# EAGLE design pc_pulse (EAGLE 6.4)
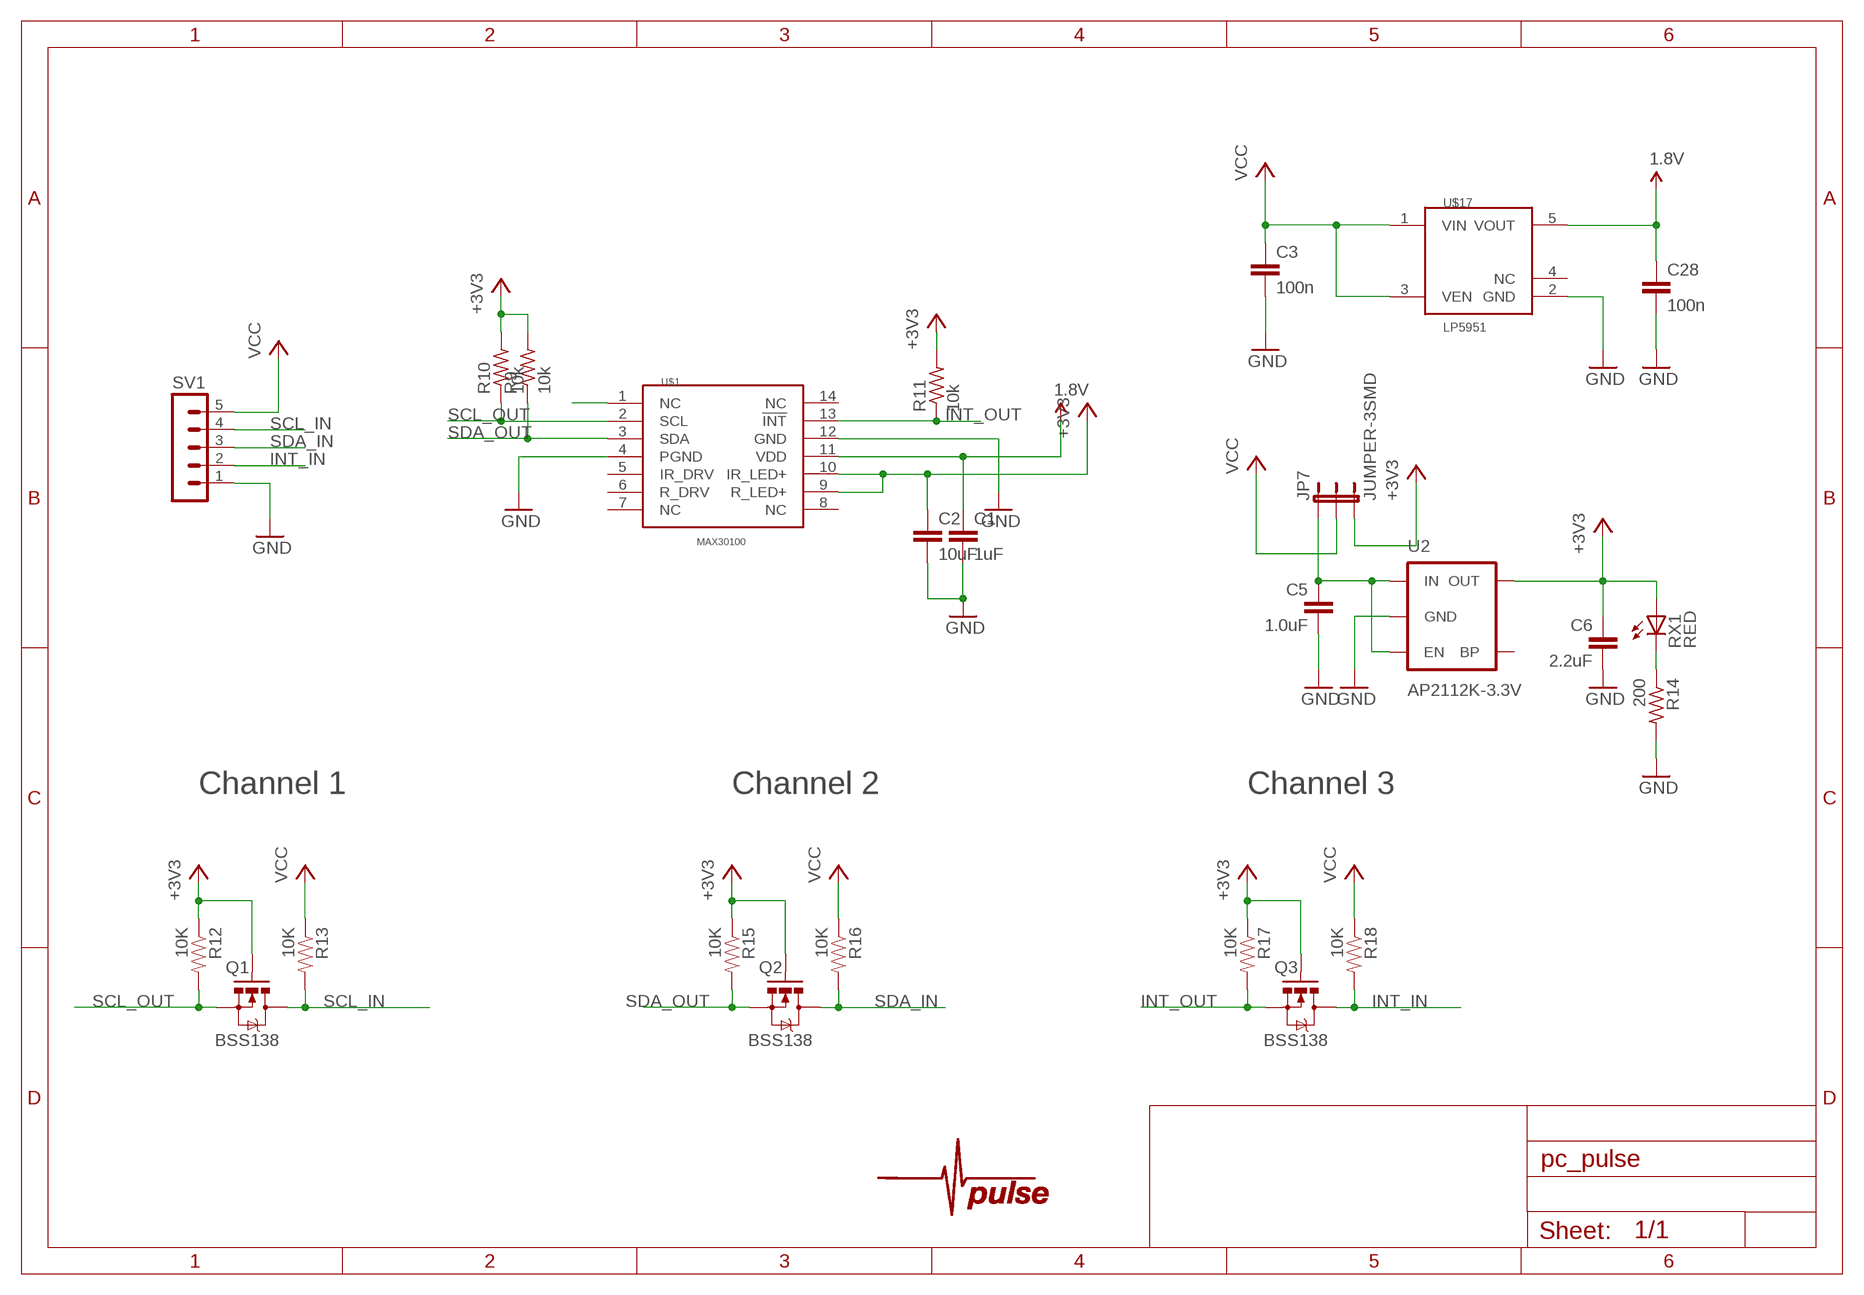
[diagram p0: schematic, sheet 1]

## Parts
C1  1uF  C-EUC0805  [C0805]
C2  10uF  C-EUC0805  [C0805]
C3  100n  C-EUC0402  [C0402]
C5  1.0uF  1.0UF-25V-+80/-20(0805)  [0805]
C6  2.2uF  C-EUC0805  [C0805]
C28  100n  C-EUC0402  [C0402]
JP7  JUMPER-3SMD  [SJ_3]
Q1  BSS138  MOSFET-NCHANNELSMD  [SOT23-3]
Q2  BSS138  MOSFET-NCHANNELSMD  [SOT23-3]
Q3  BSS138  MOSFET-NCHANNELSMD  [SOT23-3]
R9  10k  R-US_R0402  [R0402]
R10  10k  R-US_R0402  [R0402]
R11  10k  R-US_R0402  [R0402]
R12  10K  RESISTOR0402-RES  [0402-RES]
R13  10K  RESISTOR0402-RES  [0402-RES]
R14  200  R-US_R0402  [R0402]
R15  10K  RESISTOR0402-RES  [0402-RES]
R16  10K  RESISTOR0402-RES  [0402-RES]
R17  10K  RESISTOR0402-RES  [0402-RES]
R18  10K  RESISTOR0402-RES  [0402-RES]
RX1  RED  LEDCHIPLED_0603  [CHIPLED_0603]
SV1  MA05-1  [MA05-1]
U2  AP2112K-3.3V  V_REG_LDOSMD  [SOT23-5]
U$1  MAX30100  [OESIP-14]
U$3  PROTY_LOGO_WITH_TEXT  [PROTY_WITH_TEXT]
U$4  PULSE  [PULSE]
U$17  LP5951  [SC70-5]

## Nets
1.8V: C1.1 C28.1 U$1.11(VDD) U$17.5(VOUT)
+3V3: C2.1 C6.1 JP7.3 Q1.1(G) Q2.1(G) Q3.1(G) R9.2 R10.2 R11.2 R12.1 R15.1 R17.1 RX1.A U2.5(OUT) U$1.9(R_LED+) U$1.10(IR_LED+)
GND: C1.2 C2.2 C3.2 C5.2 C6.2 C28.2 R14.2 SV1.1 U2.2(GND) U$1.4(PGND) U$1.12(GND) U$17.2(GND)
INT_IN: Q3.3(D) R18.2 SV1.2
INT_OUT: Q3.2(S) R11.1 R17.2 U$1.13(!INT)
N$1: C5.1 JP7.1 U2.1(IN) U2.3(EN)
N$2: U$1.1(NC)
N$11: R14.1 RX1.C
SCL_IN: Q1.3(D) R13.2 SV1.4
SCL_OUT: Q1.2(S) R10.1 R12.2 U$1.2(SCL)
SDA_IN: Q2.3(D) R16.2 SV1.3
SDA_OUT: Q2.2(S) R9.1 R15.2 U$1.3(SDA)
VCC: C3.1 JP7.2 R13.1 R16.1 R18.1 SV1.5 U$17.1(VIN) U$17.3(VEN)
Unconnected: U2.4(BP) U$1.5(IR_DRV) U$1.6(R_DRV) U$1.7(NC) U$1.8(NC) U$1.14(NC) U$17.4(NC)

## Notes on the sheet
- Channel 1 | Channel 2 | Channel 3

## Library data of the parts
C1-C3 C6 C28 = rcl:C-EU: CAPACITOR, European symbol
C5 = SparkFun-Capacitors:1.0UF-25V-+80/-20(0805): CAP-11625; PROD_ID: CAP-11625
JP7 = SparkFun:JUMPER-3
Q1-Q3 = SparkFun:MOSFET-NCHANNEL
R9-R11 R14 = rcl:R-US_: RESISTOR, American symbol
R12 R13 R15-R18 = SparkFun:RESISTOR: Resistor Basic schematic elements and footprints for 0603, 1206, and PTH resistors.
RX1 = led:LED: LED OSRAM: - CHIPLED LG R971, LG N971, LY N971, LG Q971, LY Q971, LO R971, LY R971 LH N974, LH R974 LS Q976, LO Q976, LY Q976 LO Q996 - Hyper CHIPLED LW Q18S LB Q993, LB Q99A, LB R99A - SideLED LS A670, LO A670, LY A670, LG A670, LP A670 LB A673, LV A673, LT A673, LW A673 LH A674 LY A675 LS A676, LA A676, LO A676, LY A676, LW A676 LS A679, LY A679, LG A679 - Hyper Micro SIDELED® LS Y876, LA Y876, LO Y876, LY Y876 LT Y87S - SmartLED LW L88C, LW L88S LB L89C, LB L89S, LG L890 LS L89K, LO L89K, LY L89K LS L896, LA L896, LO L896, LY L896 - TOPLED LS T670, LO T670, LY T670, LG T670, LP T670 LSG T670, LSP T670, LSY T670, LOP T670, LYG T670 LG T671, LOG T671, LSG T671 LB T673, LV T673, LT T673, LW T673 LH T674 LS T676, LA T676, LO T676, LY T676, LB T676, LH T676, LSB T676, LW T676 LB T67C, LV T67C, LT T67C, LS T67K, LO T67K, LY T67K, LW E67C LS E67B, LA E67B, LO E67B, LY E67B, LB E67C, LV E67C, LT E67C LW T67C LS T679, LY T679, LG T679 LS T770, LO T770, LY T770, LG T770, LP T770 LB T773, LV T773, LT T773, LW T773 LH T774 LS E675, LA E675, LY E675, LS T675 LS T776, LA T776, LO T776, LY T776, LB T776 LHGB T686 LT T68C, LB T68C - Hyper Mini TOPLED® LB M676 - Mini TOPLED Santana® LG M470 LS M47K, LO M47K, LY M47K Source: http://www.osram.convergy.de LUXEON: - LUMILED® LXK2-PW12-R00, LXK2-PW12-S00, LXK2-PW14-U00, LXK2-PW14-V00 LXK2-PM12-R00, LXK2-PM12-S00, LXK2-PM14-U00 LXK2-PE12-Q00, LXK2-PE12-R00, LXK2-PE12-S00, LXK2-PE14-T00, LXK2-PE14-U00 LXK2-PB12-K00, LXK2-PB12-L00, LXK2-PB12-M00, LXK2-PB14-N00, LXK2-PB14-P00, LXK2-PB14-Q00 LXK2-PR12-L00, LXK2-PR12-M00, LXK2-PR14-Q00, LXK2-PR14-R00 LXK2-PD12-Q00, LXK2-PD12-R00, LXK2-PD12-S00 LXK2-PH12-R00, LXK2-PH12-S00 LXK2-PL12-P00, LXK2-PL12-Q00, LXK2-PL12-R00 Source: www.luxeon.com KINGBRIGHT: KA-3528ASYC Source: www.kingbright.com
SV1 = con-lstb:MA05-1: PIN HEADER; OC_FARNELL: unknown; OC_NEWARK: unknown
U2 = SparkFun-PowerIC:V_REG_LDO: Voltage Regulator LDO Standard 150mA LDO voltage regulator in SOT-23 layout. Micrel part MIC5205. BP (by-pass) pin is used to lower output noise with 470pF cap.; PROD_ID: VREG-12457
U$1 = circuitects:MAX30100
U$3 = circuitects:PROTY_LOGO_WITH_TEXT
U$4 = circuitects:PULSE
U$17 = circuitects:LP5951

## Board
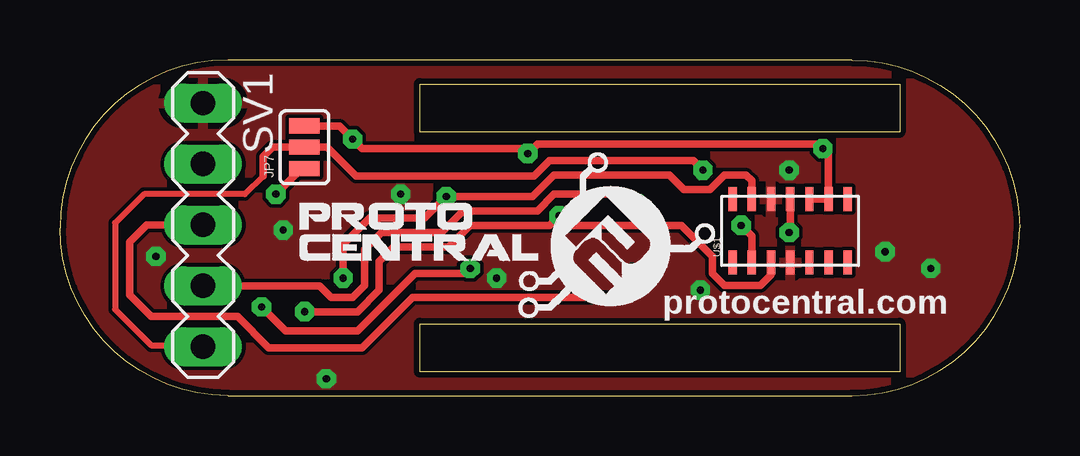
[diagram p1: board, top side]
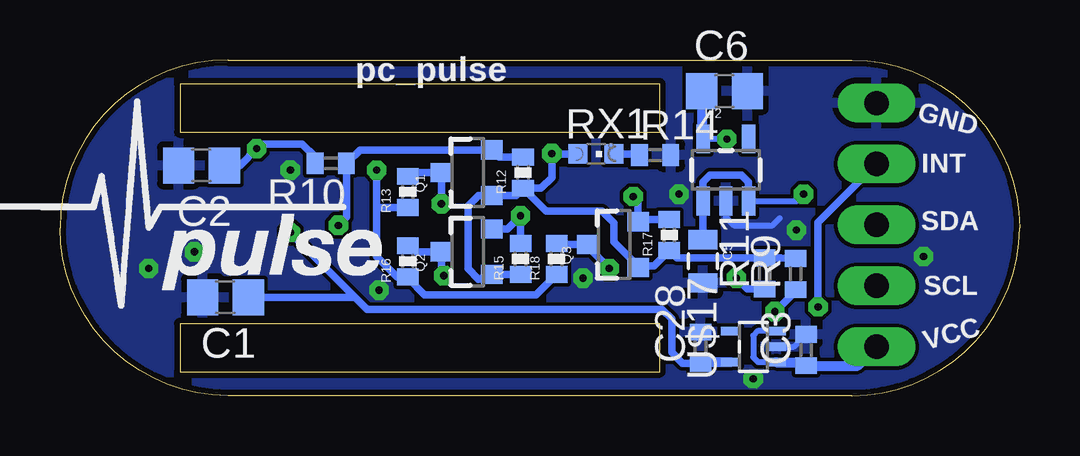
[diagram p2: board, bottom side, seen from below]

Size 40 x 14 mm. Coordinates in mm from the lower left corner, seen from the top.
Outline: 7,0 33,0 arc90 40,7 arc90 33,14 7,14 arc90 0,7 arc90 7,0
Outline: 15,13 35,13 35,11 15,11 15,13
Outline: 15,3 35,3 35,1 15,1 15,3
Copper layers (1*2*15*16): Top 0.035mm / dielectric 1.5mm / Route2 0.035mm / dielectric 0.15mm / Route15 0.035mm / dielectric 0.2mm / Bottom 0.035mm
Design rules "Circuitects-Rules": minimum track width 6mil, minimum drill 0.3mm, track to track 6mil, track to pad 6mil, pad to pad 6mil, via to via 6mil, smd to smd 6mil, copper to edge 10mil, drill to drill 8mil, minimum pad ring 12mil, minimum via ring 10mil, stop-mask expansion 4mil, vias tented up to drill 25mil, thermal gap 10mil

### Footprints (pad centres in the part's own frame; a part is rotated, then mirrored left to right if it is on the bottom)
C0805 = smd 1.3 x 1.5: 1 -0.95,0; 2 0.95,0
C0402 = smd 0.7 x 0.9: 1 -0.65,0; 2 0.65,0
0805 = smd 0.8 x 1.2: 1 -0.9,0; 2 0.9,0
SJ_3 = smd 0.635 x 1.27: 1 -0.889,0; 2 0,0; 3 0.889,0
SOT23-3 = smd 0.8 x 0.9: 1 -0.95,-1; 2 0.95,-1; 3 0,1.1
R0402 = smd 0.7 x 0.9: 1 -0.65,0; 2 0.65,0
0402-RES = smd 0.7 x 0.9: 1 -0.65,0; 2 0.65,0
CHIPLED_0603 = smd 0.8 x 0.8: A 0,-0.75; C 0,0.75
MA05-1 = drill 1.016 long: 1 -5.08,0; 2 -2.54,0; 3 0,0; 4 2.54,0; 5 5.08,0
SOT23-5 = smd 0.55 x 1.2: 1 -0.95,-1.3; 2 0,-1.3; 3 0.95,-1.3; 4 0.95,1.3; 5 -0.95,1.3
OESIP-14 = smd 1 x 0.35: 1 -1.325,2.4; 2 -1.325,1.6; 3 -1.325,0.8; 4 -1.325,0; 5 -1.325,-0.8; 6 -1.325,-1.6; 7 -1.325,-2.4; 8 1.325,-2.4; 9 1.325,-1.6; 10 1.325,-0.8; 11 1.325,0; 12 1.325,0.8; 13 1.325,1.6; 14 1.325,2.4
SC70-5 = smd 0.35 x 0.8: 1 -0.65,-0.95; 2 0,-0.95; 3 0.65,-0.95; 4 0.65,0.95; 5 -0.65,0.95

### Placement (x,y rotation side)
C1  33.1,4.1 180 bottom
C2  34.1,9.6 180 bottom
C3  8.9,1.9 90 bottom
C5  13.2,5.6 270 bottom
C6  12.3,12.7 0 bottom
C28  13.3,2 90 bottom
JP7  10.19,10.36 90 top
Q1  23,9.3 90 bottom
Q2  23,6 90 bottom
Q3  16.9,6.3 90 bottom
R9  9.33,5.07 90 bottom
R10  28.71,9.69 180 bottom
R11  10.63,5.09 90 bottom
R12  20.7,9.3 90 bottom
R13  25.5,8.5 90 bottom
R14  15.19,10.03 0 bottom
R15  20.8,5.7 90 bottom
R16  25.5,5.6 90 bottom
R17  14.6,6.7 90 bottom
R18  19.3,5.7 90 bottom
RX1  17.66,10.08 270 bottom
SV1  5.96,7.12 270 top
U2  12.24,9.41 0 bottom
U$1  30.44,6.87 90 top
U$3  8.9,3.2 0 top
U$4  46.2,3.1 0 bottom  (outside the outline)
U$17  11.09,2.04 90 bottom

### Tracks (layer width: path | path; a pad name or v marks a point on that pad's centre or on a via)
1.8V  (via drill 0.3)
  Top 0.305: U$1.11 30.44,6.84 v30.4,6.8
  Bottom 0.254: 13.24,1.29 C28.1
  Bottom 0.305: C28.1 14.05,1.35 14.5,1.8 14.5,3.2 14.9,3.6 27.2,3.6 27.7,4.1 | 27.7,4.1 v30.4,6.8 | C1.1 27.7,4.1
  Bottom 0.406: U$17.5 13.26,1.39 C28.1
+3V3  (via drill 0.3)
  Top 0.305: JP7.3 11.65,11.25 v12.2,10.7 12.6,10.3 19.3,10.3 v19.5,10.1 19.9,10.5 31.6,10.5 v31.8,10.3 32.04,10.06 U$1.9 U$1.10
  Bottom 0.254: U2.5 12.11,10.71 v12.2,10.7
  Bottom 0.305: R9.2 9.95,5.74 R11.2 14.29,5.74 R17.1 15.25,5.4 15.9,5.4 | Q3.1 15.9,5.4 | 15.9,5.4 16.9,6.4 16.9,7.2 17.4,7.7 19.75,7.7 R12.1 | R12.1 19.95,8.65 19.5,9.1 v19.5,10.1 19.48,10.08 RX1.A | R12.1 21,8.35 Q1.1 22.55,8.35 23,7.9 23,5.3 22.55,4.85 Q2.1 R15.1 | R10.2 29.36,9.96 29.9,10.5 31.6,10.5 v31.8,10.3 32.5,9.6 C2.1
  Bottom 0.406: C6.1 13.25,10.77 U2.5
GND  (via drill 0.3)
  Bottom 0.254: U2.2 12.24,7.44 11.9,7.1 10.3,7.1 10,7.4 | U$17.2 9.41,2.04 C3.2
  other vias: 9.3,6.9 36.3,5.3 4,5.8 11.1,0.7 34.4,6 14.2,8.4 26.7,4.4 30.4,9.4 18.2,4.9
  pour Top: -0.1,14.1 39.9,14.2 40.2,0 0.2,-0.1
  pour Bottom: -0.1,14 39.9,14.2 40.2,0.1 0.2,-0.1
INT_IN  (via drill 0.3)
  Top 0.305: v8.4,3.7 9.4,2.7 12.4,2.7 14.8,5.1 16.9,5.1 v17.1,5.3
  Bottom 0.305: R18.2 19.25,6.3 Q3.3 18,6.2 v17.1,5.3 | v8.4,3.7 8.4,7.22 SV1.2
INT_OUT  (via drill 0.3)
  Top 0.305: U$1.13 28.84,8.96 28.6,9.2 27.7,9.2 27.1,8.6 26,8.6 25.4,9.2 20.6,9.2 19.7,8.3 v16.1,8.3 15.2,7.4 12.9,7.4 11.8,6.3 v11.8,4.9
  Bottom 0.305: v16.1,8.3 15.9,8.1 Q3.2 15.8,7.35 R17.2 | R11.1 11.34,4.44 v11.8,4.9
N$1  (via drill 0.3)
  Top 0.305: JP7.1 10.07,9.47 v9,8.4
  Bottom 0.254: U2.3 9.29,8.11 v9,8.4
  Bottom 0.305: C5.1 U2.1 13.19,8.91 12.9,9.2 11.6,9.2 11.3,8.9 U2.3
N$11
  Bottom 0.305: RX1.C 15.99,10.08 R14.1
SCL_IN  (via drill 0.3)
  Top 0.305: v24.1,8 23.7,8.4 20.6,8.4 19.9,7.7 16.8,7.7 15.9,6.8 13.4,6.8 12.7,6.1 12.7,4.6 12.2,4.1 11.3,4.1 10.82,4.58 SV1.4
  Bottom 0.305: R13.2 25.45,9.3 Q1.3 v24.1,8
SCL_OUT  (via drill 0.3)
  Top 0.305: U$1.2 28.84,6.66 v28.4,7.1
  Bottom 0.305: R12.2 21.7,9.95 Q1.2 27.5,10.25 R10.1 28.06,7.44 v28.4,7.1
SDA_IN  (via drill 0.3)
  Top 0.305: v24,5 23.1,4.1 14.7,4.1 12.6,2 8.7,2 7.4,3.3 3.8,3.3 2.9,4.2 2.9,6.4 3.62,7.12 SV1.3
  Bottom 0.305: R16.2 25.25,6 Q2.3 24.1,5.1 v24,5
SDA_OUT  (via drill 0.3)
  Top 0.305: U$1.3 29.64,5.04 29.2,4.6 27.7,4.6 27.2,5.1 27.2,5.8 25.9,7.1 21.2,7.1 v20.8,7.5 20.4,7.1 17.1,7.1 16.2,6.2 13.9,6.2 13.3,5.6 13.3,4.4 12.4,3.5 v10.2,3.5
  Bottom 0.305: R15.2 v20.8,7.5 21.35,6.95 Q2.2 | R9.1 9.33,4.37 v10.2,3.5
VCC  (via drill 0.3)
  Top 0.254: 8.46,9.16 7.7,8.4 3.5,8.4 2.3,7.2 2.3,3.6 3.8,2.1 5.9,2.1 SV1.5
  Top 0.305: v26.8,9.4 26.4,9.8 20.4,9.8 19.76,9.16 12.34,9.16 11.14,10.36 JP7.2 8.86,10.36 8.46,9.96 8.46,9.16
  Bottom 0.254: U$17.3 10.91,2.69 11.1,2.5 11.1,1.6 10.9,1.4 U$17.1
  Bottom 0.305: R18.1 20.15,4.2 24.8,4.2 25.5,4.9 R16.1 25.95,4.95 26.8,5.8 26.8,7.9 | 26.8,7.9 v26.8,9.4 | R13.1 26.75,7.85 26.8,7.9
  Bottom 0.406: SV1.5 6.75,1.25 C3.1 9.04,1.39 U$17.1

### Text on the board
tPlace: protocentral.com
bPlace: pc_pulse | GND | INT | SDA | SCL | VCC